# Altium schematic sheet 12V_Rest.SchDoc
size A; SheetNumber: 5; SheetTotal: 9
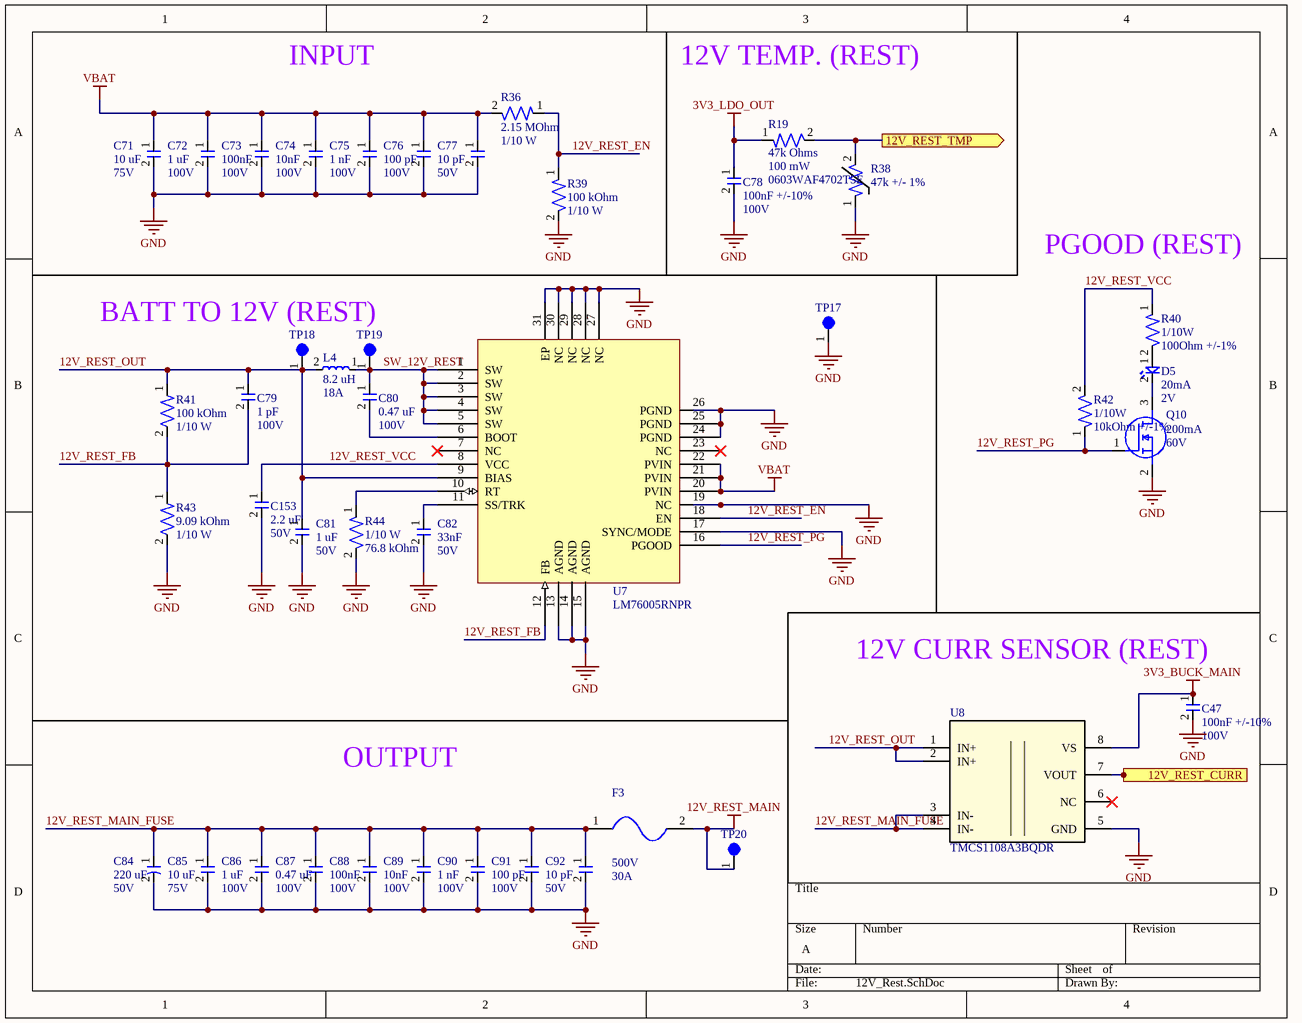
[diagram p0: 12V_Rest.SchDoc]

## Parts
C47  Capacitance: 100nF +/-10%  Voltage Rating: 100V  [CAP-0603]  (hidden comment: CC0603KRX7R0BB104)
C71  Capacitance: 10 uF  Voltage Rating: 75V  [CAP-1210]  (hidden comment: C3225X7R1N106K250AC)
C72  Capacitance: 1 uF  Voltage: 100V  [CAP-1206 - duplicate]  (hidden comment: CL31B105KCHNNNE)
C73  Capacitance: 100nF  Voltage Rating: 100V  [CAP-0603]  (hidden comment: CC0603KRX7R0BB104)
C74  Capacitance: 10nF  Voltage Rating: 100V  [CAP-0603]  (hidden comment: C1608C0G2A103J080AC)
C75  Capacitance: 1 nF  Voltage: 100V  [CAP-0603]  (hidden comment: C0603Y102K1RAC7867)
C76  Capacitance: 100 pF  Voltage: 100V  [CAP-0603]  (hidden comment: 0603N101J101CT)
C77  Capacitance: 10 pF  Voltage Rating: 50V  [CAP-0603]  (hidden comment: 0603N100J500CT)
C78  Capacitance: 100nF +/-10%  Voltage Rating: 100V  [CAP-0603]  (hidden comment: CC0603KRX7R0BB104)
C79  Capacitance: 1 pF  Voltage: 100V  [CAP-0603]  (hidden comment: 885012006087)
C80  Capacitance: 0.47 uF  Voltage: 100V  [CAP-0805]  (hidden comment: KAM21KR72A474KL)
C81  Capacitance: 1 uF  Voltage: 50V  [CAP-0603]  (hidden comment: UMK107AB7105KA-T)
C82  Capacitance: 33nF  Voltage Rating: 50V  [CAP-0603]  (hidden comment: CC0603KRX7R9BB333)
C84  Capacitance: 220 uF  Voltage Rating: 50V  [ELEC-220U-0003]  (hidden comment: 50TZV220M10X10.5)
C85  Capacitance: 10 uF  Voltage Rating: 75V  [CAP-1210]  (hidden comment: C3225X7R1N106K250AC)
C86  Capacitance: 1 uF  Voltage: 100V  [CAP-1206 - duplicate]  (hidden comment: CL31B105KCHNNNE)
C87  Capacitance: 0.47 uF  Voltage: 100V  [CAP-0805]  (hidden comment: KAM21KR72A474KL)
C88  Capacitance: 100nF  Voltage Rating: 100V  [CAP-0603]  (hidden comment: CC0603KRX7R0BB104)
C89  Capacitance: 10nF  Voltage Rating: 100V  [CAP-0603]  (hidden comment: C1608C0G2A103J080AC)
C90  Capacitance: 1 nF  Voltage: 100V  [CAP-0603]  (hidden comment: C0603Y102K1RAC7867)
C91  Capacitance: 100 pF  Voltage: 100V  [CAP-0603]  (hidden comment: 0603N101J101CT)
C92  Capacitance: 10 pF  Voltage Rating: 50V  [CAP-0603]  (hidden comment: 0603N100J500CT)
C153  Capacitance: 2.2 uF  oltage: 50V  [CAP-0603]  (hidden comment: UMK107BBJ225KA-T)
D5  Current Rating: 20mA  Vf: 2V  [LED-0603]  (hidden comment: 150060AS75000)
F3  Voltage Rating: 500V  Current: 30A  [FUSE-ATM-0001]  (hidden comment: 3568)
L4  Inductance: 8.2 uH  DCI: 18A  [PWRIND-8.2U-0002]  (hidden comment: IHLP6767GZER8R2M01)
Q10  Id-Continuous: 200mA  VDS-Max: 60V  [NMOS-SOT23-3]  (hidden comment: T2N7002AK,LM)
R19  0603WAF4702T5E  [RES-0603]
R36  Resistance: 2.15 MOhm  Power: 1/10 W  [RES-0603]  (hidden comment: RC0603FR-072M15L)
R38  Resistance: 47k +/- 1%  [RES-0402]  (hidden comment: TMP6431DECR)
R39  Resistance: 100 kOhm  Power: 1/10 W  [RES-0603]  (hidden comment: RC0603FR-07100KL)
R40  Power Rating: 1/10W  Resistance: 100Ohm +/-1%  [RES-0603]  (hidden comment: AC0603FR-10100RL)
R41  Resistance: 100 kOhm  Power: 1/10 W  [RES-0603]  (hidden comment: RC0603FR-07100KL)
R42  Power Rating: 1/10W  Resistance: 10kOhm +/-1%  [RES-0603]  (hidden comment: RC0603FR-0710KP)
R43  Resistance: 9.09 kOhm  Power: 1/10 W  [RES-0603]  (hidden comment: RC0603FR-079K09L)
R44  Power: 1/10 W  Resistance: 76.8 kOhm  [RES-0603]  (hidden comment: RC0603FR-0776K8L)
TP17  5003  [TEST-POINT-0001]  (value not drawn)
TP18  5003  [TEST-POINT-0001]  (value not drawn)
TP19  5003  [TEST-POINT-0001]  (value not drawn)
TP20  5003  [TEST-POINT-0001]  (value not drawn)
U7  LM76005RNPR  [IC-30-WQFN(6x4)]
U8  TMCS1108A3BQDR  [D0008A-IPC_A]

## Ports
12V_REST_CURR (out, see can-stm32g4[1D]), 12V_REST_TMP (out, see can-stm32g4[1D])

## Nets
3V3_BUCK_MAIN: C47.1 U8.8(VS)
3V3_LDO_OUT: C78.1 R19.1
12V_REST_MAIN: F3.2 TP20.1
GND: C47.2 C71.2 C72.2 C73.2 C74.2 C75.2 C76.2 C77.2 C78.2 C81.2 C82.2 C84.2 C85.2 C86.2 C87.2 C88.2 C89.2 C90.2 C91.2 C92.2 C153.2 Q10.2(S) R38.1 R39.2 R43.2 R44.2 TP17.1 U7.13(AGND) U7.14(AGND) U7.15(AGND) U7.17(SYNC/MODE) U7.19(NC) U7.24(PGND) U7.25(PGND) U7.26(PGND) U7.27(NC) U7.28(NC) U7.29(NC) U7.30(NC) U7.31(EP) U8.5(GND)
VBAT: C71.1 C72.1 C73.1 C74.1 C75.1 C76.1 C77.1 R36.2 U7.20(PVIN) U7.21(PVIN) U7.22(PVIN)
12V_REST_CURR: U8.7(VOUT) ; port 12V_REST_CURR
12V_REST_EN: R36.1 R39.1 U7.18(EN)
12V_REST_FB: C79.2 R41.2 R43.1 U7.12(FB)
12V_REST_MAIN_FUSE: C84.1 C85.1 C86.1 C87.1 C88.1 C89.1 C90.1 C91.1 C92.1 F3.1 U8.3(IN-) U8.4(IN-)
12V_REST_OUT: C79.1 C81.1 L4.2 R41.1 TP18.1 U7.9(BIAS) U8.1(IN+) U8.2(IN+)
12V_REST_PG: Q10.1(G) R42.1 U7.16(PGOOD)
12V_REST_TMP: R19.2 R38.2 ; port 12V_REST_TMP
12V_REST_VCC: C153.1 R40.1 R42.2 U7.8(VCC)
SW_12V_REST: C80.1 L4.1 TP19.1 U7.1(SW) U7.2(SW) U7.3(SW) U7.4(SW) U7.5(SW)
NetC80_2: C80.2 U7.6(BOOT)
NetC82_1: C82.1 U7.11(SS/TRK)
NetD5_1: D5.1 R40.2
NetD5_2: D5.2 Q10.3(D)
NetR44_1: R44.1 U7.10(RT)

Not connected (* = marked no-connect by the designer): U7 7(NC)* 23(NC)*; U8 6(NC)*

## Notes on the sheet
- INPUT
- 12V TEMP. (REST)
- (near R40) PGOOD (REST)
- BATT TO 12V (REST)
- (near C47) 12V CURR SENSOR (REST)
- OUTPUT
- (in symbol RES-47k-0001-JLC) 47k Ohms; 100 mW

## Library data of the parts
C47 C73 C78 C88 = CAP-100N-0001: CAP CER 0.1UF 100V X7R 0603; Manufacturer: YAGEO; Assembled?: no; Manufacturer Part Number: CC0603KRX7R0BB104; Temperature Coefficient: X7R; Package Size: 0603
C71 C85 = CAP-10U-0004: 10 µF ±10% 75V Ceramic Capacitor X7R 1210 (3225 Metric)
C72 C86 = CAP-1U-0001: 1 µF ±10% 100V Ceramic Capacitor X7R 1206 (3216 Metric)
C74 C89 = CAP-10N-0002: CAP CER 10000PF 100V C0G 0603; Manufacturer: TDK Corporation; Temperature Coefficient: C0G/NP0; Assembled?: no; Manufacturer Part Number: C1608C0G2A103J080AC; Package Size: 0603
C75 C90 = CAP-1N-0001: 1000 pF ±10% 100V Ceramic Capacitor X7R 0603 (1608 Metric)
C76 C91 = CAP-100P-0002: 100 pF ±5% 100V Ceramic Capacitor C0G, NP0 0603 (1608 Metric); Tolerance: +/-5%; Temp Coeff: C0G/NP0; Package Size: 0603
C77 C92 = CAP-10P-0001: 10 pF ±5% 50V Ceramic Capacitor C0G, NP0 0603 (1608 Metric); Manufacturer: Walshin Technology Corporation; Assembled?: Yes; Manufacturer Part Number: 0603N100J500CT; Temperature Coefficient: C0G, NP0; Package Size: 0603
C79 = CAP-1P-0001: 1 pF ±0.25pF 100V Ceramic Capacitor C0G, NP0 0603 (1608 Metric); Tolerance: +/- 0.25 pF; Temperature Coefficient: C0G/NP0; Assembled?: No; Package Size: 0603
C80 C87 = CAP-0.47U-0001: 0.47 µF ±10% 100V Ceramic Capacitor X7R 0805 (2012 Metric); Tolerance: +/- 10%; Assembled?: No; Temperature Coefficient: X7R; Package Size: 0805
C81 = CAP-1U-0002: 1 µF ±10% 50V Ceramic Capacitor X7R 0603 (1608 Metric); Package Size: 0603
C82 = CAP-33N-0001: 0.033 µF ±10% 50V Ceramic Capacitor X7R 0603 (1608 Metric); Manufacturer: YAGEO; Assembled?: no; Manufacturer Part Number: CC0603KRX7R9BB333; Temperature Coefficient: X7R; Package Size: 0603
C84 = ELEC-220U-0003: 220 µF 50 V Aluminum Electrolytic Capacitors Radial, Can - SMD 2000 Hrs @ 105°C; Size: .406inx.406in*.413in
C153 = CAP-2.2U-0001: 2.2 µF ±10% 50V Ceramic Capacitor X5R 0603 (1608 Metric)
D5 = LED_Amber_0001: CAP CER 0.1UF 100V X7R 0603; Manufacturer: Wurth Electronik; Assembled?: no; Color: Amber; Manufacturer Part Number: 150060AS75000; Package Size: 0603
F3 = FUSE-ATM-0001: Fuse Holder 30 A 500V 1 Circuit Blade Through Hole; Manufacturer Part Number: 3568
L4 = PWRIND-8.2U-0002: 8.2 µH Shielded Molded Inductor 18 A 10.66mOhm Max Nonstandard; Isat: 25A; Tolerance: +/-20%; DCR: 10.66 mOhm
Q10 = NMOS-200MA-0001: MOSFET N-CH 60V 200MA SOT23; Manufacturer: Toshiba; FET type: N-Channel; Rds On-Max: 3.9Ohm; Vgs-Max: 20V; Assembled?: no; Manufacturer Part Number: T2N7002AK,LM; Package: SOT-23-3
R19 = RES-47k-0001-JLC: 100mW Thick Film Resistors 75V ±100ppm/℃ ±1% 47kΩ 0603 Chip Resistor - Surface Mount ROHS; Resistance: 47kOhms; Power: 100mW
R36 = RES-2.15M-0001: 2.15 MOhms ±1% 0.1W, 1/10W Chip Resistor 0603 (1608 Metric) Moisture Resistant Thick Film; Tolerance: +/-1%; Assembled?: No; Package Size: 0603
R38 = THERM-47K-0001: PTC Thermistor 47 kOhms 0402 (1006 Metric); Manufacturer: Texas Instruments; Manufacturer Part Number: TMP6431DECR; Package Size: 0402
R39 R41 = RES-100K-0003: 100 kOhms ±1% 0.1W, 1/10W Chip Resistor 0603 (1608 Metric) Moisture Resistant Thick Film; Tolerance: +/- 1%; Assembled?: No; Package Size: 0603
R40 = RES-100-0002: 100 Ohms ±1% 0.1W, 1/10W Chip Resistor 0603 (1608 Metric) Automotive AEC-Q200 Thick Film; Manufacturer: YAGEO; Assembled?: no; Manufacturer Part Number: AC0603FR-10100RL; Package Size: 0603
R42 = RES-10K-0002: RES SMD 10K OHM 1% 1/10W 0603; Manufacturer: YAGEO; Assembled?: no; Manufacturer Part Number: RC0603FR-0710KP; Package Size: 0603
R43 = RES-9.09K-0001: 9.09 kOhms ±1% 0.1W, 1/10W Chip Resistor 0603 (1608 Metric) Moisture Resistant Thick Film; Tolerance: +/-1%; Assembled?: No; Package Size: 0603
R44 = RES-76.8K-0001: 76.8 kOhms ±1% 0.1W, 1/10W Chip Resistor 0603 (1608 Metric) Moisture Resistant Thick Film; Manufacturer: Yageo; Tolerance: +/- 1%; Package Size: 0603
TP17-TP20 = TEST-POINT-0001: Oranange PC Test Point, Miniature Phoisphor Bronze Silver Plating Through Hole Mounting Type
U7 = IC-BUCK-0006: Buck Switching Regulator IC Positive Adjustable 1V 1 Output 5A 30-WFQFN Exposed Pad; Manufacturer: Texas Instruments; Assembled?: no; Manufacturer Part Number: LM76005RNPR; Type: Buck; Package: 30-WFQFN; Current: LM76005RNPR
U8 = IC-CURRENT-0005: Mfr_Name: Texas Instruments; TYPE: TYPE; RefDes: RefDes